# EAGLE design 7-channel-PWM_compact (EAGLE 6.6.0)
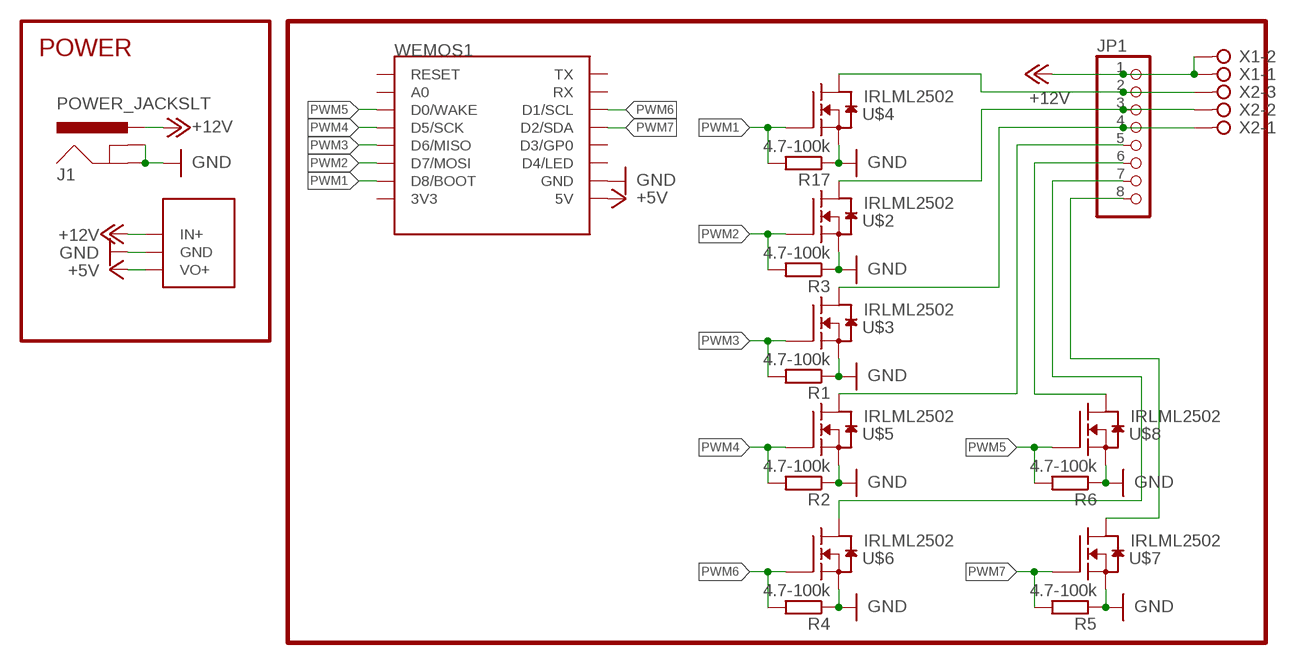
[diagram p0: schematic, sheet 1]

## Parts
J1  POWER_JACKSLT  [POWER_JACK_SLOT]
JP1  PINHD-1X08_2.54-S  [1X08-S]
R1  4.7-100k  R-EU_R0805  [R0805]
R2  4.7-100k  R-EU_R0805  [R0805]
R3  4.7-100k  R-EU_R0805  [R0805]
R4  4.7-100k  R-EU_R0805  [R0805]
R5  4.7-100k  R-EU_R0805  [R0805]
R6  4.7-100k  R-EU_R0805  [R0805]
R17  4.7-100k  R-EU_R0805  [R0805]
U$1  BUCK_CONVERTER_TE818_VAR  [BUCK_CONVERTER_TE818_VAR]
U$2  IRLML2502  N-CH_IRLML2502  [SOT23]
U$3  IRLML2502  N-CH_IRLML2502  [SOT23]
U$4  IRLML2502  N-CH_IRLML2502  [SOT23]
U$5  IRLML2502  N-CH_IRLML2502  [SOT23]
U$6  IRLML2502  N-CH_IRLML2502  [SOT23]
U$7  IRLML2502  N-CH_IRLML2502  [SOT23]
U$8  IRLML2502  N-CH_IRLML2502  [SOT23]
WEMOS1  WEMOS-D1-MINI  [WEMOS-D1-MINI]
X1  W237-02P  [W237-132]
X2  W237-03P  [W237-133]

## Nets
+5V: U$1.VO+ WEMOS1.5V
+12V: J1.PWR JP1.1 U$1.IN+ X1.1 X1.2
GND: J1.GND@1(GNDBREAK) J1.GND@2(GND) R1.1 R2.1 R3.1 R4.1 R5.1 R6.1 R17.1 U$1.GND U$2.2(S) U$3.2(S) U$4.2(S) U$5.2(S) U$6.2(S) U$7.2(S) U$8.2(S) WEMOS1.GND
N$2: JP1.2 U$4.3(D) X2.3
N$4: JP1.3 U$2.3(D) X2.2
N$5: JP1.4 U$3.3(D) X2.1
N$6: JP1.5 U$5.3(D)
N$8: JP1.6 U$8.3(D)
N$9: JP1.7 U$6.3(D)
N$12: JP1.8 U$7.3(D)
PWM1: R17.2 U$4.1(G) WEMOS1.D8(D8/BOOT)
PWM2: R3.2 U$2.1(G) WEMOS1.D7(D7/MOSI)
PWM3: R1.2 U$3.1(G) WEMOS1.D6(D6/MISO)
PWM4: R2.2 U$5.1(G) WEMOS1.D5(D5/SCK)
PWM5: R6.2 U$8.1(G) WEMOS1.D0(D0/WAKE)
PWM6: R4.2 U$6.1(G) WEMOS1.D1(D1/SCL)
PWM7: R5.2 U$7.1(G) WEMOS1.D2(D2/SDA)
Unconnected: WEMOS1.3V3 WEMOS1.A0 WEMOS1.D3(D3/GP0) WEMOS1.D4(D4/LED) WEMOS1.RESET WEMOS1.RX WEMOS1.TX

## Notes on the sheet
- POWER

## Library data of the parts
J1 = SparkFun-Connectors:POWER_JACK: Power Jack Connector This is the standard 5.5mm barrel jack for power. The PTH is the most common, proven, reliable, footprint. The Slot footprint only works if the mill layer is transmitted to the PCB fab house so be warned. Here are the connectors we sell at SparkFun: DC Barrel Power Jack/Connector <https://www.sparkfun.com/products/119> (PRT-00119) DC Barrel Power Jack/Connector (SMD) <https://www.sparkfun.com/products/12748> (PRT-12748) DC Barrel Jack Adapter - Breadboard Compatible <https://www.sparkfun.com/products/10811> (PRT-10811) It is used on this SparkFun product (and many, many others): SparkFun RedBoard - Programmed with Arduino <https://www.sparkfun.com/products/12757> (DEV-12757) Also, if you need a mating power supply or connector, please check these out: Wall Adapter Power Supply - 9VDC 650mA <https://www.sparkfun.com/products/298> (TOL-00298) DC Barrel Jack Adapter - Male <https://www.sparkfun.com/products/10287> (PRT-10287); PROD_ID: PRT-00119
JP1 = pinhead-2:PINHD-1X08: PIN HEADER
R1-R6 R17 = rcl:R-EU_: RESISTOR, European symbol
U$1 = diyHue:BUCK_CONVERTER_TE818
U$2-U$8 = diyHue:N-CH_IRLML2502
WEMOS1 = esp8266modules:WEMOS-D1-MINI: WeMos.cc D1 mini ESP8266 module
X1 = con-wago-508:W237-02P: WAGO SREW CLAMP; OC_FARNELL: unknown; OC_NEWARK: unknown
X2 = con-wago-508:W237-03P: WAGO SREW CLAMP; OC_FARNELL: unknown; OC_NEWARK: unknown

## Net classes
0 default: width 0.406 mm, drill 0.5 mm, clearance 0.127 mm

## Board
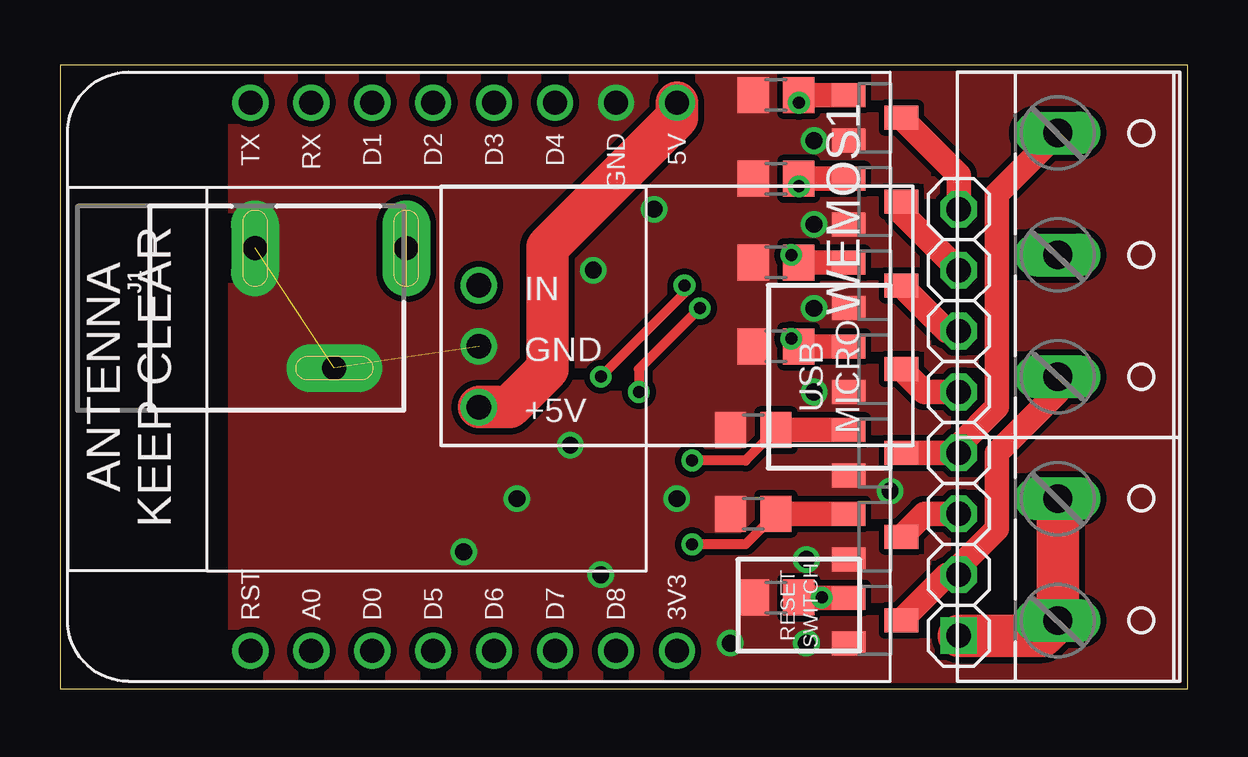
[diagram p1: board, top side]
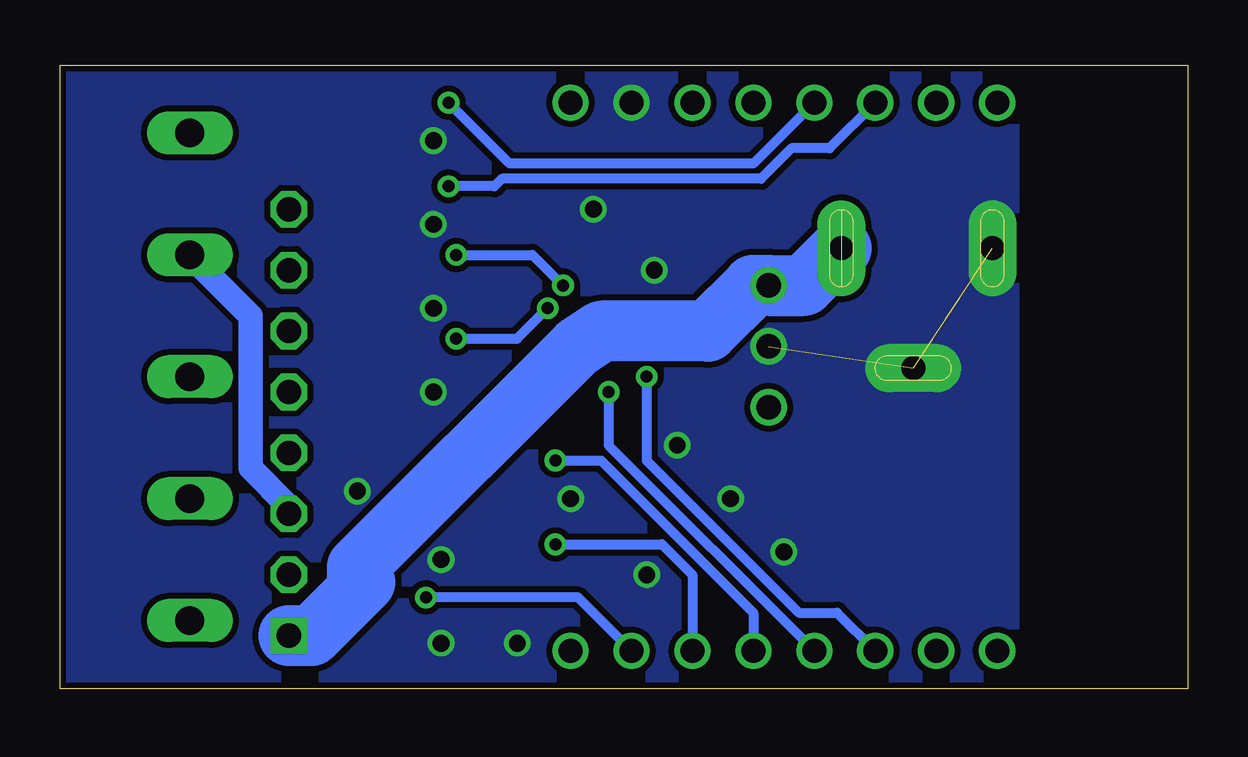
[diagram p2: board, bottom side, seen from below]

Size 47 x 26 mm. Coordinates in mm from the lower left corner, seen from the top.
Outline: 0,0 47,0 47,26 0,26 0,0
Copper layers (1*16): Top 0.035mm / dielectric 1.5mm / Bottom 0.035mm
Design rules "jlcpcb *": minimum track width 3.5mil, minimum drill 0.2mm, track to track 5mil, track to pad 5mil, pad to pad 5mil, via to via 5mil, smd to smd 0mil, copper to edge 0.2mm, drill to drill 8mil, minimum pad ring 10mil, minimum via ring 8mil, stop-mask expansion 4mil, vias tented up to drill 1mm, thermal gap 10mil

### Footprints (pad centres in the part's own frame; a part is rotated, then mirrored left to right if it is on the bottom)
POWER_JACK_SLOT = drill 1 pad 2 long: GND@1 2.58,7.5; GND@2 7.58,10.8; PWR 2.58,13.8
1X08-S = drill 1.016 square: 1 -8.89,0 | drill 1.016 octagon: 2 -6.35,0; 3 -3.81,0; 4 -1.27,0; 5 1.27,0; 6 3.81,0; 7 6.35,0; 8 8.89,0
R0805 = smd 1.3 x 1.5: 1 -0.95,0; 2 0.95,0
BUCK_CONVERTER_TE818_VAR = drill 1.016: GND 0,-1.27; IN+ 0,1.27; VO+ 0,-3.81
SOT23 = smd 1 x 1.4: 1 -0.95,-1.1; 2 0.95,-1.1; 3 0,1.1
WEMOS-D1-MINI = drill 1: 3V3 -10.16,-10.16; 5V 12.7,-10.16; A0 -10.16,5.08; D0 -10.16,2.54; D1 12.7,2.54; D2 12.7,0; D3 12.7,-2.54; D4 12.7,-5.08; D5 -10.16,0; D6 -10.16,-2.54; D7 -10.16,-5.08; D8 -10.16,-7.62; GND 12.7,-7.62; RESET -10.16,7.62; RX 12.7,5.08; TX 12.7,7.62
W237-132 = drill 1.194 long: 1 -2.54,-0.635; 2 2.54,-0.635
W237-133 = drill 1.194 long: 1 -5.08,-0.635; 2 0,-0.635; 3 5.08,-0.635

### Placement (x,y rotation side)
J1  0.64,20.95 270 top
JP1  37.47,11.11 90 top
R1  28.89,10.79 0 top
R2  29.84,14.29 0 top
R3  28.89,7.3 0 top
R4  29.84,21.27 0 top
R5  29.84,24.77 0 top
R6  29.84,17.78 0 top
R17  29.84,3.81 0 top
U$1  17.46,15.56 0 top
U$2  33.97,6.35 270 top
U$3  33.97,9.84 270 top
U$4  33.97,2.86 270 top
U$5  33.97,13.34 270 top
U$6  33.97,20.32 270 top
U$7  33.97,23.81 270 top
U$8  33.97,16.83 270 top
WEMOS1  15.56,11.75 90 top
X1  42.23,5.4 270 top
X2  42.23,18.1 270 top

### Tracks (layer width: path | path; a pad name or v marks a point on that pad's centre or on a via)
+5V
  Top 1.778: WEMOS1.5V 25.72,23.81 20.32,18.41 20.32,13.34 18.73,11.75 U$1.VO+
+12V
  Top 1.778: JP1.1 40.96,2.22 X1.2 X1.1
  Bottom 2.54: J1.PWR 15.98,16.83 U$1.IN+ 18.1,16.83 20,14.92 24.45,14.92 25.4,14.29 34.61,5.08 34.61,4.76 34.29,4.45 36.51,2.22 JP1.1
GND  (via drill 0.7)  (2 unrouted)
  other vias: 16.83,5.71 21.27,10.16 19.05,7.94 25.72,7.94 22.54,4.76 27.94,1.91 31.11,1.91 31.43,15.88 31.43,12.38 31.11,5.4 31.43,19.37 31.43,22.86 22.23,17.46 24.77,20 34.61,8.26
  pour Bottom (isolate 0.254, no thermals): 7.3,27.3 47.31,26.99 47.31,-1.91 7.3,-1.59
  pour Top (isolate 0.254, no thermals): 7.3,27.94 48.58,27.94 48.58,-2.22 7.3,-2.22
N$2
  Top 1.016: U$4.3 36.98,4.76 JP1.2 37.47,5.08 39.05,6.67 39.05,9.84 41.59,12.38 X2.3
N$4
  Top 1.016: JP1.3 36.02,7.3 U$2.3
  Bottom 1.016: JP1.3 37.47,7.62 39.05,9.21 39.05,15.56 X2.2
N$5
  Top 1.016: U$3.3 JP1.4 37.47,10.16 39.05,11.75 39.05,20.64 X2.1
N$6
  Top 1.016: JP1.5 36.02,12.38 U$5.3
N$8
  Top 1.016: JP1.6 36.98,14.92 U$8.3
N$9
  Top 1.016: JP1.7 35.07,19.86 U$6.3
N$12
  Top 1.016: JP1.8 37.47,21.42 U$7.3
PWM1  (via drill 0.5)
  Top 0.406: v31.75,3.81
  Top 1.016: U$4.1 v31.75,3.81 31.11,3.81 R17.2
  Bottom 0.406: v31.75,3.81 25.4,3.81 WEMOS1.D8
PWM2  (via drill 0.5)
  Top 0.406: R3.2 29.53,6.99 28.57,6.03 v26.35,6.03
  Top 1.016: U$2.1 31.11,7.3 R3.2
  Bottom 0.406: WEMOS1.D7 20.64,4.76 21.91,6.03 v26.35,6.03
PWM3  (via drill 0.5)
  Top 0.406: R1.2 29.53,10.48 28.57,9.53 v26.35,9.53
  Top 1.016: U$3.1 30.8,10.79 R1.2
  Bottom 0.406: v26.35,9.53 24.45,9.53 18.1,3.17 WEMOS1.D6
PWM4  (via drill 0.5)
  Top 0.406: R2.2 v30.48,14.61 | v26.67,15.88 24.13,13.34 v24.13,12.38
  Top 1.016: U$5.1 R2.2
  Bottom 0.406: v30.48,14.61 27.94,14.61 v26.67,15.88 | v24.13,12.38 24.13,10.16 WEMOS1.D5
PWM5  (via drill 0.5)
  Top 0.406: R6.2 v30.48,18.1 | v26.04,16.83 26.04,16.51 v22.54,13.02
  Top 1.016: U$8.1 R6.2
  Bottom 0.406: v30.48,18.1 27.3,18.1 v26.04,16.83 | v22.54,13.02 22.54,9.53 16.19,3.17 14.61,3.17 WEMOS1.D0
PWM6  (via drill 0.5)
  Top 0.406: v30.8,20.95 R4.2
  Top 1.016: U$6.1 R4.2
  Bottom 0.406: v30.8,20.95 28.89,20.95 28.57,21.27 17.78,21.27 16.51,22.54 14.92,22.54 WEMOS1.D1
PWM7  (via drill 0.5)
  Top 0.406: v30.8,24.45 R5.2
  Top 1.016: U$7.1 R5.2
  Bottom 0.406: v30.8,24.45 28.26,21.91 18.1,21.91 WEMOS1.D2